# Altium schematic sheet Sheet1.SchDoc
size 400 x 279 mm; SheetNumber: 1; SheetTotal: 1
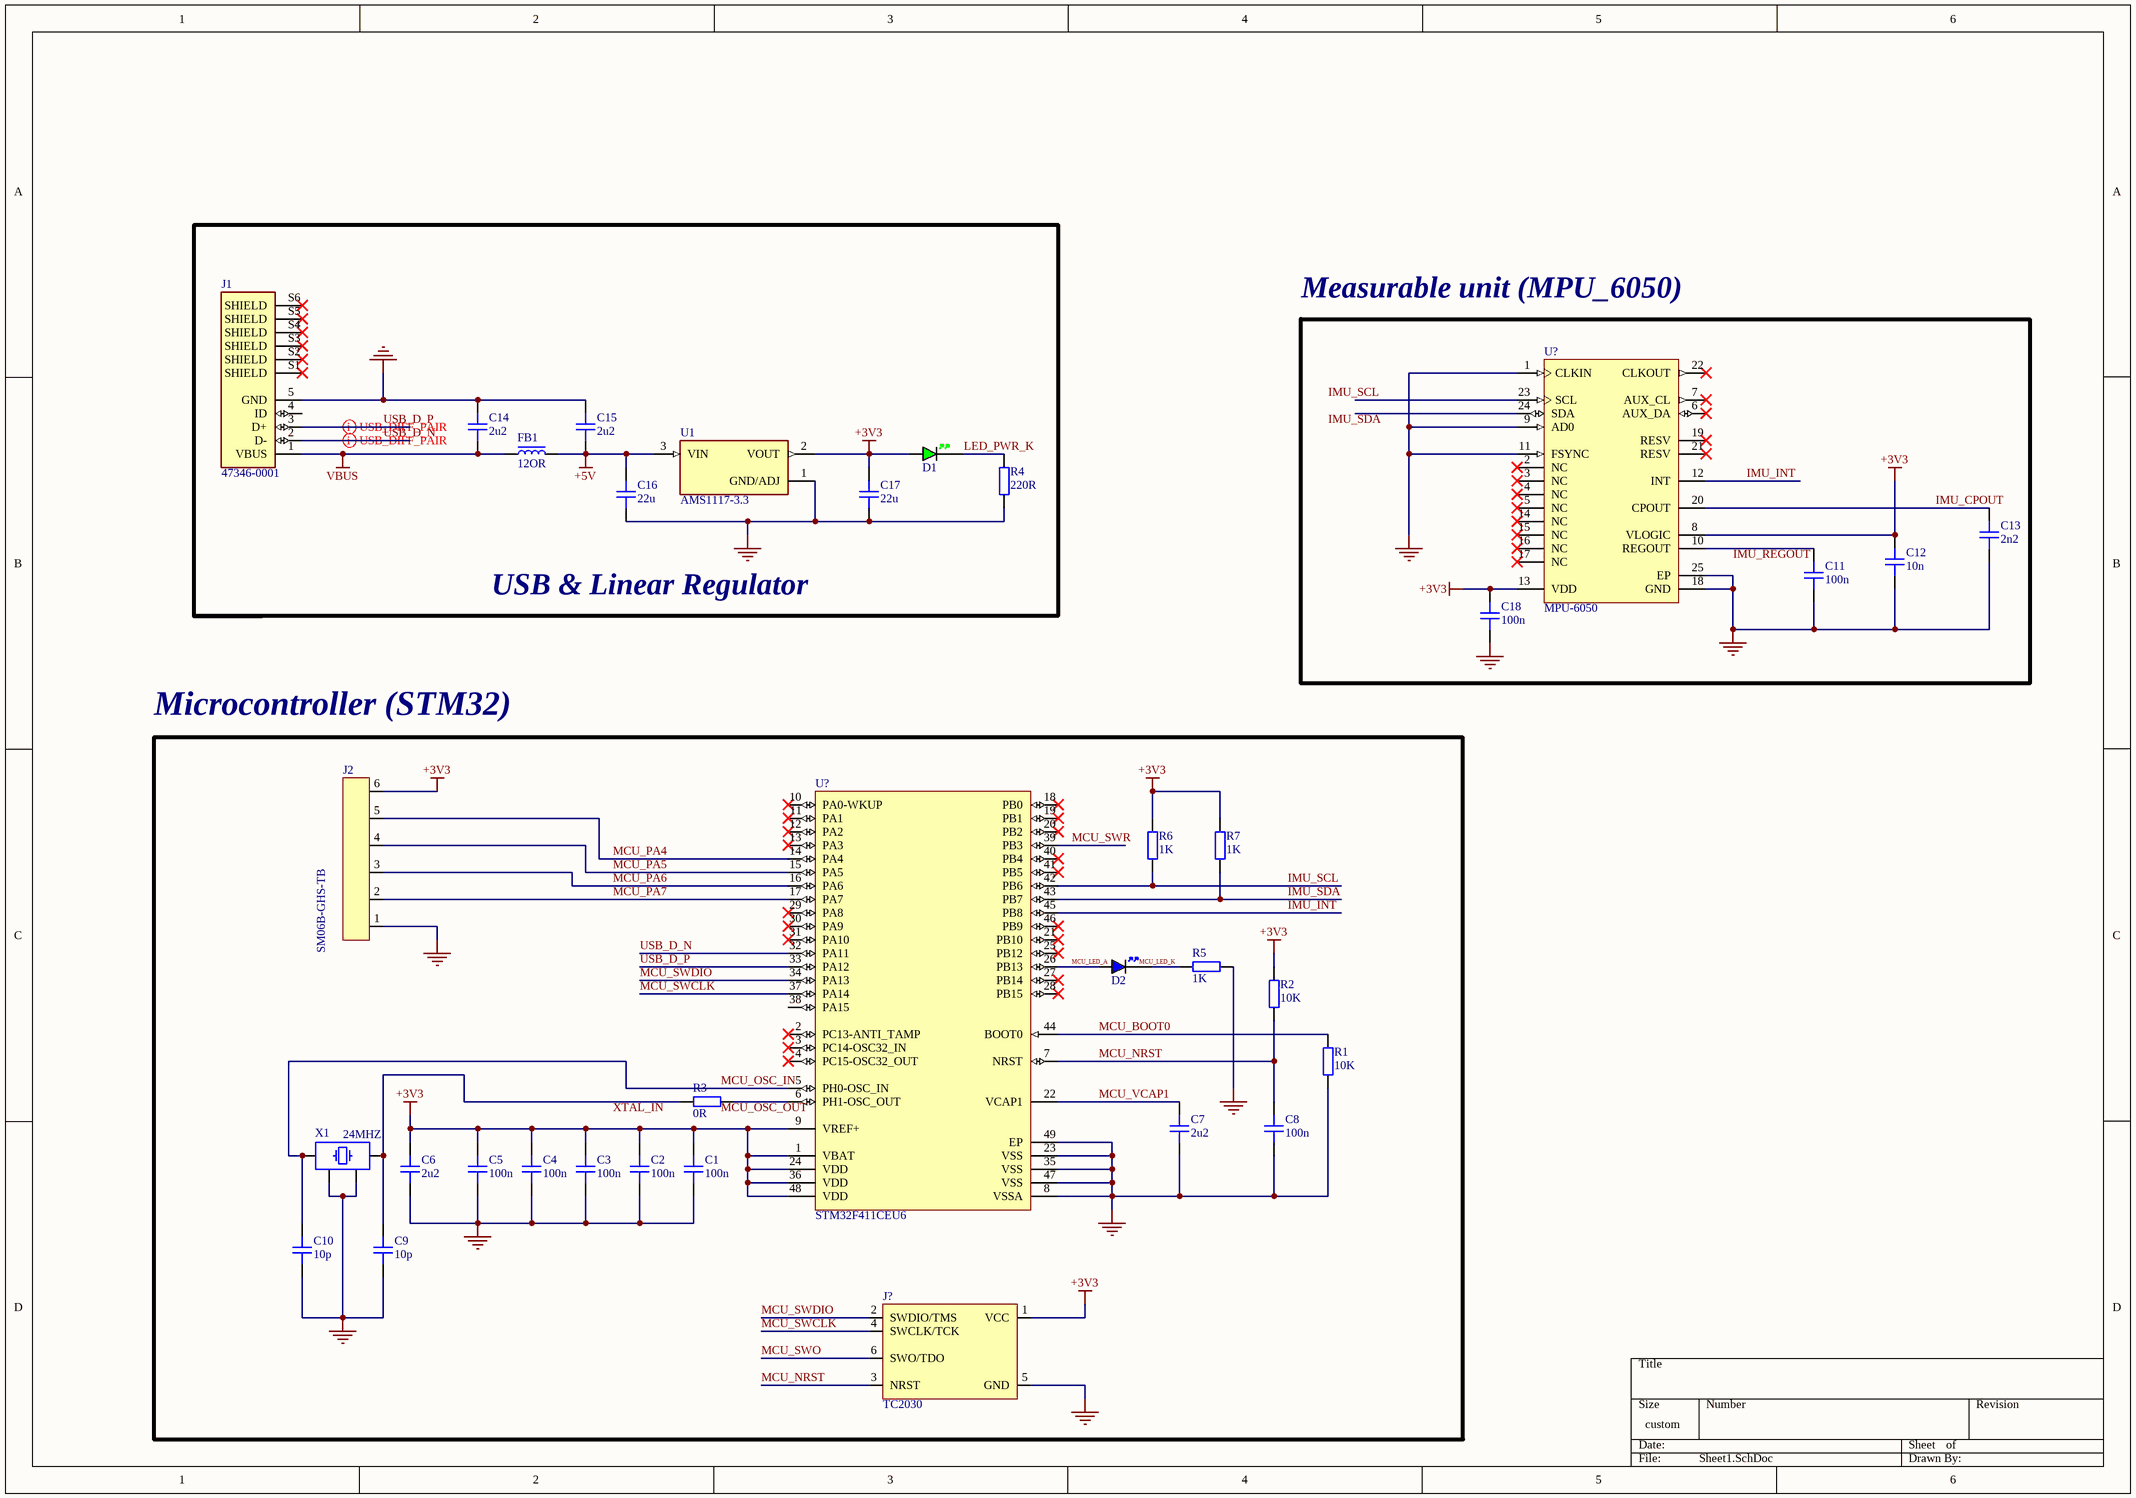
[diagram p0: Sheet1.SchDoc]

## Parts
(Parts that share a designator on the sheet are numbered #1, #2 ... from top to bottom, then left to right.)
C1  100n  [CAP_0402]
C2  100n  [CAP_0402]
C3  100n  [CAP_0402]
C4  100n  [CAP_0402]
C5  100n  [CAP_0402]
C6  2u2  [CAP_0603]
C7  2u2  [CAP_0603]
C8  100n  [CAP_0402]
C9  10p  [CAP_0402]
C10  10p  [CAP_0402]
C11  100n  [CAP_0402]
C12  10n  [CAP_0402]
C13  2n2  [CAP_0402]
C14  2u2  [CAP_0603]
C15  2u2  [CAP_0603]
C16  22u  [CAP_0805]
C17  22u  [CAP_0805]
C18  100n  [CAP_0402]
D1  GREEN  [LED_0402_GREEN]  (value not drawn)
D2  BLUE  [LED_0402_BLUE]  (value not drawn)
FB1  12OR  [FB_0603]
J1  47346-0001  [MOLEX_47346-0001]
J2  SM06B-GHS-TB  [SM06B-GHS-TB]
J?  TC2030  [TC2030-FP]  (no BOM)
R1  10K  [RES_0402]
R2  10K  [RES_0402]
R3  0R  [RES_0402]
R4  220R  [RES_0402]
R5  1K  [RES_0402]
R6  1K  [RES_0402]
R7  1K  [RES_0402]
U1  AMS1117-3.3  [SOT229P700X180-4N]
U?#1  MPU-6050  [IS-QFN-24_V]
U?#2  STM32F411CEU6  [STM-UFQFPN48_L]
X1  24MHZ  [XTAL_2016]

## Blocks framed on the sheet
Measurable unit (MPU_6050): C11-C13 C18 U?#1
Microcontroller (STM32): C1-C10 D2 J2 J? R1-R3 R5-R7 U?#2 X1

## Nets
+3V3: C1.2 C2.1 C3.2 C4.2 C5.2 C6.2 C12.2 C17.2 C18.2 D1.A J2.6 J?.1(VCC) R2.2 R6.1 R7.1 U1.2(VOUT) U?#1.8(VLOGIC) U?#1.13(VDD) U?#2.1(VBAT) U?#2.9(VREF+) U?#2.24(VDD) U?#2.36(VDD) U?#2.48(VDD)
+5V: C15.1 C16.2 FB1.2 U1.3(VIN)
GND: C1.1 C2.2 C3.1 C4.1 C5.1 C6.1 C7.1 C8.1 C9.1 C10.1 C11.1 C12.1 C13.1 C14.2 C15.2 C16.1 C17.1 C18.1 J1.5(GND) J2.1 J?.5(GND) R1.1 R4.1 R5.1 U1.1(GND/ADJ) U?#1.1(CLKIN) U?#1.9(AD0) U?#1.11(FSYNC) U?#1.18(GND) U?#1.25(EP) U?#2.8(VSSA) U?#2.23(VSS) U?#2.35(VSS) U?#2.47(VSS) U?#2.49(EP) X1.2 X1.4
VBUS: C14.1 FB1.1 J1.1(VBUS)
IMU_CPOUT: C13.2 U?#1.20(CPOUT)
IMU_INT: U?#1.12(INT) U?#2.45(PB8)
IMU_SCL: R6.2 U?#2.42(PB6)
IMU_SDA: R7.2 U?#2.43(PB7)
LED_PWR_K: D1.K R4.2
MCU_BOOT0: R1.2 U?#2.44(BOOT0)
MCU_LED_A: D2.A U?#2.26(PB13)
MCU_NRST: C8.2 J?.3(NRST) R2.1 U?#2.7(NRST)
MCU_OSC_IN: C10.2 U?#2.5(PH0-OSC_IN) X1.1
MCU_PA4: J2.5 U?#2.14(PA4)
MCU_PA5: J2.4 U?#2.15(PA5)
MCU_PA6: J2.3 U?#2.16(PA6)
MCU_PA7: J2.2 U?#2.17(PA7)
MCU_SWCLK: J?.4(SWCLK/TCK) U?#2.37(PA14)
MCU_SWDIO: J?.2(SWDIO/TMS) U?#2.34(PA13)
MCU_SWO: J?.6(SWO/TDO)
MCU_SWR: U?#2.39(PB3)
MCU_VCAP1: C7.2 U?#2.22(VCAP1)
USB_D_N: J1.2(D-) U?#2.32(PA11)
USB_D_P: J1.3(D+) U?#2.33(PA12)
NetC9_2: C9.2 R3.2 X1.3
NetC11_2: C11.2 U?#1.10(REGOUT)
NetD2_K: D2.K R5.2
NetR3_1: R3.1 U?#2.6(PH1-OSC_OUT)

Not connected (* = marked no-connect by the designer): J1 4(ID) S1(SHIELD)* S2(SHIELD)* S3(SHIELD)* S4(SHIELD)* S5(SHIELD)* S6(SHIELD)*; U?#1 2(NC)* 3(NC)* 4(NC)* 5(NC)* 6(AUX_DA)* 7(AUX_CL)* 14(NC)* 15(NC)* 16(NC)* 17(NC)* 19(RESV)* 21(RESV)* 22(CLKOUT)* 23(SCL) 24(SDA); U?#2 2(PC13-ANTI_TAMP)* 3(PC14-OSC32_IN)* 4(PC15-OSC32_OUT)* 10(PA0-WKUP)* 11(PA1)* 12(PA2)* 13(PA3)* 18(PB0)* 19(PB1)* 20(PB2)* 21(PB10)* 25(PB12)* 27(PB14)* 28(PB15)* 29(PA8)* 30(PA9)* 31(PA10)* 38(PA15) 40(PB4)* 41(PB5)* 46(PB9)*

## Layout directives
differential pair: USB_D_N, USB_D_P

## Notes on the sheet
- USB & Linear Regulator
- Labels drawn without touching a wire or pin: IMU_REGOUT, IMU_SCL, IMU_SDA, MCU_LED_K, MCU_OSC_OUT, XTAL_IN

## Library data of the parts
C1-C5 C8-C13 C18 = CAP_0402: Capacitor SMD 0402; Manufacturer: *; Manufacturer Part Number: *; Distributor Link: *; LCSC: *; Rating: *; Dielectric: *
C6 C7 C14 C15 = CAP_0603: Capacitor SMD 0603; Manufacturer: *; Manufacturer Part Number: *; Distributor Link: *; LCSC: *; Rating: *; Dielectric: *
C16 C17 = CAP_0805: Capacitor SMD 0805; Manufacturer: *; Manufacturer Part Number: *; Distributor Link: *; LCSC: *; Rating: *; Dielectric: *
D1 = LED_0402_GREEN: LED 0402 GREEN SMD
D2 = LED_0402_BLUE: LED 0402 BLUE SMD
FB1 = FB_0603: Ferrite Bead SMD 0603; Manufacturer: *; Manufacturer Part Number: *; Distributor Link: *; LCSC: *
J1 = 47346-0001: USB - micro B USB 2.0 Receptacle Connector 5 Position Surface Mount, Right Angle; MF: Molex; SnapEDA_Link: https://www.snapeda.com/parts/47346-0001/Molex/view-part/?ref=snap; Package: None; MP: 47346-0001; Check_prices: https://www.snapeda.com/parts/47346-0001/Molex/view-part/?ref=eda; Purchase-URL: https://pricing.snapeda.com/search/part/47346-0001/?ref=eda; Price: None; Value: *; Availability: In Stock
J2 = SM06B-GHS-TB: Header Connector 6 Position 1.25MM Pitch SMD Horizontal JST GH; Manufacturer: JST; Manufacturer Part Number: SM06B-GHS-TB
J? = TC2030: Tag-Connect No-Solder SWD Debug Connector DO NOT PLACE; Manufacturer: Tag-Connect; Manufacturer Part Number: TC2030
R1-R7 = RES_0402: Resistor SMD 0402; Manufacturer: *; Manufacturer Part Number: *; Distributor Link: *; LCSC: *
U1 = AMS1117-3.3: Sot223/Pkg 1-Amp 3.3-Volt Low Drop Out Voltage Regulatator; MF: Advanced Monolithic Systems; Package: SOT-223 Seeed Technology; Value: *; Check_prices: https://www.snapeda.com/parts/AMS1117-3.3/Advanced+Monolithic+Systems/view-part/?ref=eda; Price: None; Availability: Not in stock; MP: AMS1117-3.3; SnapEDA_Link: https://www.snapeda.com/parts/AMS1117-3.3/Advanced+Monolithic+Systems/view-part/?ref=snap
U?#1 = CMP-1753-00002-2: 3-Axis Gyroscope, Accelerometer and a Digital Motion Processor(TM) (DMP), 2.375 to 3.46 V, -40 to 85 degC, 24-Pin QFN, RoHS, Tape and Reel; Manufacturer: InvenSense; Featured Product: MPU-60506-Axis,IntegratedI²CSolution; Other Names: 1428-1007-2 / MPU6050; Sensor Type: MotionTracking; Online Catalog: MPU-6000™Series; Unit PriceUSD: Digital; Datasheet Version: Rev. 3.3, 05/2012; Category: Sensors,Transducers; Datasheet URL: http://datasheet.octopart.com/MPU-6050-InvenSense-datasheet-14421344.pdf; Family: Multifunction; Standard Package: 5,000; Manufacturer URL: http://www.invensense.com/; Output Type: Digital; Dynamic Catalog: MPU-6000™Series
U?#2 = CMP-0243-00165-1: ARM Cortex-M4 32-bit MCU+FPU, 512 KB Flash, 128 KB RAM, 36 I/Os, 48-Pin UFQFPN, -40 to 85 degC, Tray; Operating Frequency(F) (Processor speed) (MHz): 100; FLASH Size (Prog) (kB): 512; Internal RAM Size (kB): 128; I/Os (High Current): 36; Supply Voltage(Vcc) min (V): 1.7; Package Reference: 48-Pin Ultra Thin Fine Pitch Quad Flat No-Lead, 7 x 7 x 0.6 mm Body, 0.5 mm Pitch, Exposed Pad; ComponentLink1Description: Manufacturer URL; ComponentLink1URL: http://www.st.com/; Packing: Tray; Package Description: UFQFPN48; Core: ARM Cortex-M4; ComponentLink2Description: Datasheet; ComponentLink2URL: http://www.st.com/st-web-ui/static/active/en/resource/technical/document/datasheet/DM00115249.pdf; DatasheetVersion: Rev. 6; Mounting Technology: Surface Mount
X1 = XTAL_2016: Crystal SMD 4-Pin 2.0x1.6mm; Distributor Link: *